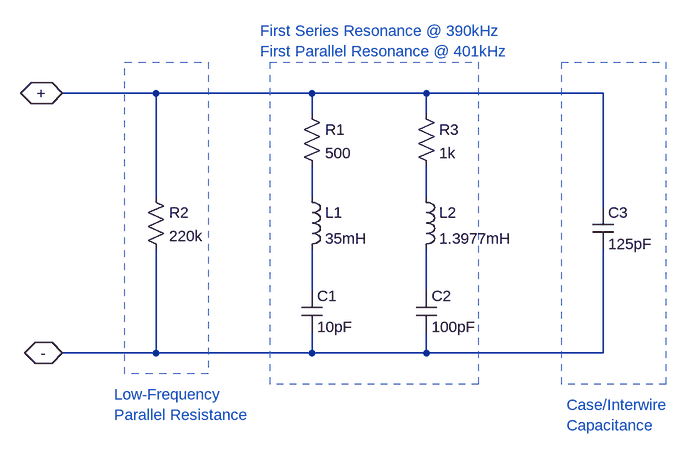
[diagram p0: schematic SMATR400H99XDA.asc]
SMATR400H99XDA.asc, the LTspice schematic file:
Version 4
SHEET 1 880 680
WIRE -160 -96 -304 -96
WIRE 80 -96 -160 -96
WIRE 256 -96 80 -96
WIRE 528 -96 256 -96
WIRE 80 -64 80 -96
WIRE 256 -64 256 -96
WIRE -160 64 -160 -96
WIRE 80 64 80 16
WIRE 256 64 256 16
WIRE 528 80 528 -96
WIRE 80 208 80 144
WIRE 256 208 256 144
WIRE -160 304 -160 144
WIRE -160 304 -304 304
WIRE 80 304 80 272
WIRE 80 304 -160 304
WIRE 256 304 256 272
WIRE 256 304 80 304
WIRE 528 304 528 144
WIRE 528 304 256 304
FLAG -304 -96 +
IOPIN -304 -96 BiDir
FLAG -304 304 -
IOPIN -304 304 BiDir
SYMBOL ind 64 48 R0
SYMATTR InstName L1
SYMATTR Value 35mH
SYMBOL res 64 -80 R0
SYMATTR InstName R1
SYMATTR Value 500
SYMBOL cap 64 208 R0
SYMATTR InstName C1
SYMATTR Value 10pF
SYMBOL res -176 48 R0
SYMATTR InstName R2
SYMATTR Value 220k
SYMBOL cap 240 208 R0
SYMATTR InstName C2
SYMATTR Value 100pF
SYMBOL res 240 -80 R0
SYMATTR InstName R3
SYMATTR Value 1k
SYMBOL ind 240 48 R0
SYMATTR InstName L2
SYMATTR Value 1.3977mH
SYMBOL cap 512 80 R0
SYMATTR InstName C3
SYMATTR Value 125pF
TEXT 0 -192 Left 2 ;First Series Resonance @ 390kHz\nFirst Parallel Resonance @ 401kHz
TEXT 472 384 Left 2 ;Case/Interwire\nCapacitance
TEXT -224 368 Left 2 ;Low-Frequency\nParallel Resistance
RECTANGLE Normal 336 352 16 -144 2
RECTANGLE Normal -80 336 -208 -144 2
RECTANGLE Normal 624 352 464 -144 2

The netlist it stands for:
* SMATR400H99XDA.asc
L1 N001 N003 35mH
R1 + N001 500
C1 N003 - 10pF
R2 + - 220k
C2 N004 - 100pF
R3 + N002 1k
L2 N002 N004 1.3977mH
C3 + - 125pF
* First Series Resonance @ 390kHz
* First Parallel Resonance @ 401kHz
* Case/Interwire
* Capacitance
* Low-Frequency
* Parallel Resistance
.backanno
.end